# EAGLE design raspi_active_cooling (EAGLE 9.6.1)
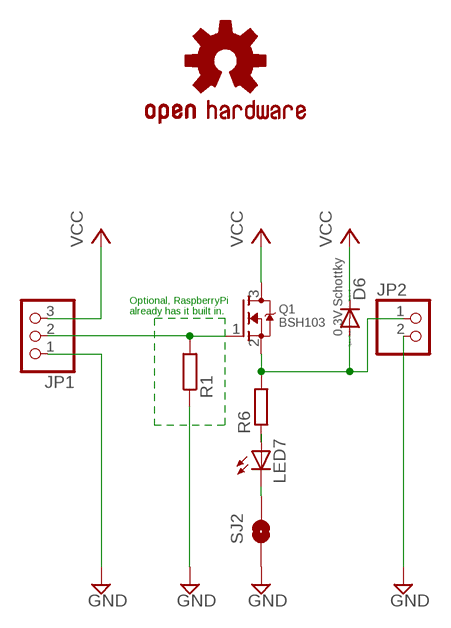
[diagram p0: schematic, sheet 1]

## Parts
D6  0.3V Schottky  DIODE-SOD523  [SOD523]
JP1  PINHD-1X3/90  [1X03/90]
JP2  PINHD-1X2/90  [1X02/90]
LED7  LED0603  [LED-0603]
LOGO1  OSHW-LOGOS  [OSHW-LOGO-S]
Q1  BSH103  MOSFET-NREFLOW  [SOT23]
R1  R-EU_R0603  [R0603]
R6  R-EU_R0603  [R0603]
SJ2  SOLDERJUMPERNO  [SJ_2S-NO]

## Nets
GND: JP1.1 JP2.2 R1.1 SJ2.2
N$1: LED7.A R6.1
N$2: LED7.C SJ2.1
N$3: D6.A JP2.1 Q1.2(S) R6.2
TRIGGER: JP1.2 Q1.1(G) R1.2
VCC: D6.C JP1.3 Q1.3(D)

## Notes on the sheet
- Optional, RaspberryPi
  already has it built in.

## Library data of the parts
D6 = diode:DIODE-: DIODE
JP1 = pinhead:PINHD-1X3: PIN HEADER
JP2 = pinhead:PINHD-1X2: PIN HEADER
LED7 = SparkFun:LED: LEDs Standard schematic elements and footprints for 5mm, 3mm, 1206, and 0603 sized LEDs. 5mm - Spark Fun Electronics SKU : COM-00529 (and others)
LOGO1 = Spark:OSHW-LOGO: Open Source Hardware Logo This logo indicates the piece of hardware it is found on incorporates a OSHW license and/or adheres to the definition of open source hardware found here: http://freedomdefined.org/OSHW
Q1 = adafruit:MOSFET-N: N-Channel Mosfet 2N7002E - 60V 260mA SOT23 [Digikey: 2N7002ET1GOSTR-ND] - REEL BSH103 - 30V 850mA SOT23 [Digikey: 568-5013-1-ND]
R1 R6 = rcl:R-EU_: RESISTOR, European symbol
SJ2 = SparkFun-Retired:SOLDERJUMPER: Solder Jumper Standard SMD solder jumper. Used to automate production. Two varients : Normally Open and Normally Closed are the same, but have different paste layers. NC will have a large amount of paste and should jumper during reflow.

## Board
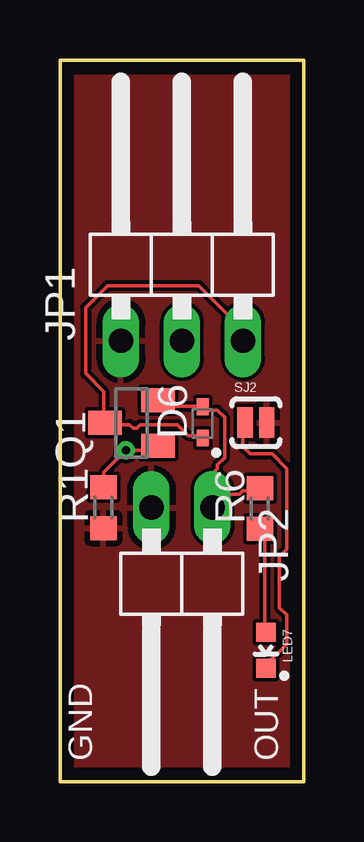
[diagram p1: board, top side]
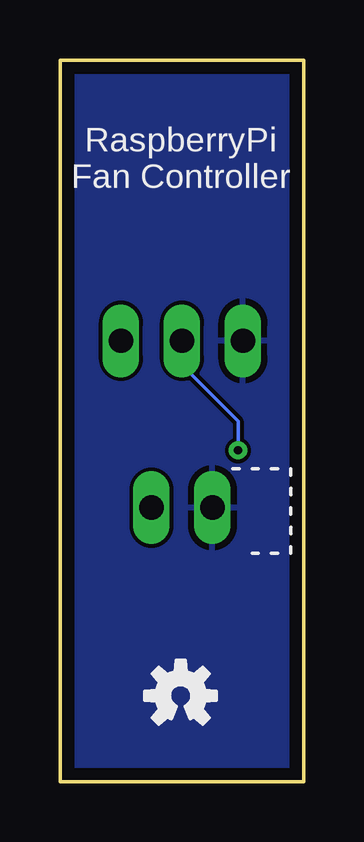
[diagram p2: board, bottom side, seen from below]

Size 10.16 x 30.08 mm. Coordinates in mm from the lower left corner, seen from the top.
Outline: 0,0 0,30.08 10.16,30.08 10.16,0 0,0
Copper layers (1*16): Top 0.035mm / dielectric 1.5mm / Bottom 0.035mm
Design rules "default *": minimum track width 6mil, minimum drill 0.35mm, track to track 6mil, track to pad 6mil, pad to pad 6mil, via to via 6mil, smd to smd 6mil, copper to edge 20mil, drill to drill 6mil, minimum pad ring 10mil, minimum via ring 8mil, stop-mask expansion 4mil, vias tented up to drill 0mil, thermal gap 10mil

### Footprints (pad centres in the part's own frame; a part is rotated, then mirrored left to right if it is on the bottom)
SOD523 = smd 0.7 x 0.5: A 0.7,0; C -0.6,0
1X03/90 = drill 1.016 long: 1 -2.54,-3.81; 2 0,-3.81; 3 2.54,-3.81
1X02/90 = drill 1.016 long: 1 -1.27,-3.81; 2 1.27,-3.81
LED-0603 = smd 0.8 x 0.8: A 0,-0.75; C 0,0.75
SOT23 = smd 1 x 1.4: 1 -0.95,-1.1; 2 0.95,-1.1; 3 0,1.1
R0603 = smd 1 x 1.1: 1 -0.85,0; 2 0.85,0
SJ_2S-NO = smd 0.635 x 1.27: 1 -0.45,0; 2 0.45,0

### Placement (x,y rotation side)
D6  5.94,14.93 90 top
JP1  5.08,22.19 0 top
JP2  5.08,7.62 180 top
LED7  8.58,5.49 180 top
LOGO1  5.13,3.59 0 bottom
Q1  2.98,14.96 90 top
R1  1.81,11.43 90 top
R6  8.33,11.39 90 top
SJ2  8.16,14.97 0 top

### Tracks (layer width: path | path; a pad name or v marks a point on that pad's centre or on a via)
GND
  pour Bottom: 0,0 10.16,0 10.16,30.08 0,30.08
  pour Top: 0,0 10.16,0 10.16,30.08 0,30.08
N$1
  Top 0.152: LED7.A 8.53,6.35 8.53,10.31 8.38,10.46 R6.1
N$2
  Top 0.152: LED7.C 8.69,4.83 8.69,4.98 9.45,5.74 9.45,6.96 9.14,7.26 9.14,9.4 9.45,9.7 9.45,13.06 8.84,13.67 7.92,13.67 7.62,13.97 7.62,14.88 SJ2.1
N$3
  Top 0.152: Q1.2 4.12,15.8 4.27,15.65 5.79,15.65 D6.A 5.94,15.49 6.55,15.49 6.86,15.19 6.86,13.51 6.55,13.21 6.55,13.06 6.4,12.9 6.4,12.45 6.86,11.99 | 6.86,11.99 7.47,11.99 7.62,12.14 8.23,12.14 R6.2 | 6.86,11.99 6.4,11.53 JP2.1 6.86,11.99
TRIGGER  (via drill 0.35)
  Top 0.152: R1.2 1.83,12.29 1.83,12.9 v2.74,13.82 3.81,13.82 3.96,13.97 Q1.1
  Bottom 0.152: v2.74,13.82 2.74,15.04 5.03,17.32 5.03,18.24 JP1.2
VCC
  Top 0.152: D6.C 5.79,14.43 5.33,14.43 4.88,14.88 3.35,14.88 3.2,14.73 3.05,14.73 2.9,14.88 1.98,14.88 Q1.3 1.83,15.04 1.83,16.26 1.07,17.02 1.07,19.76 1.98,20.68 5.79,20.68 7.62,18.85 JP1.3

### Text on the board
tPlace: GND | OUT
bPlace: RaspberryPi / Fan Controller